# Altium schematic sheet Clocl.SchDoc
size A3
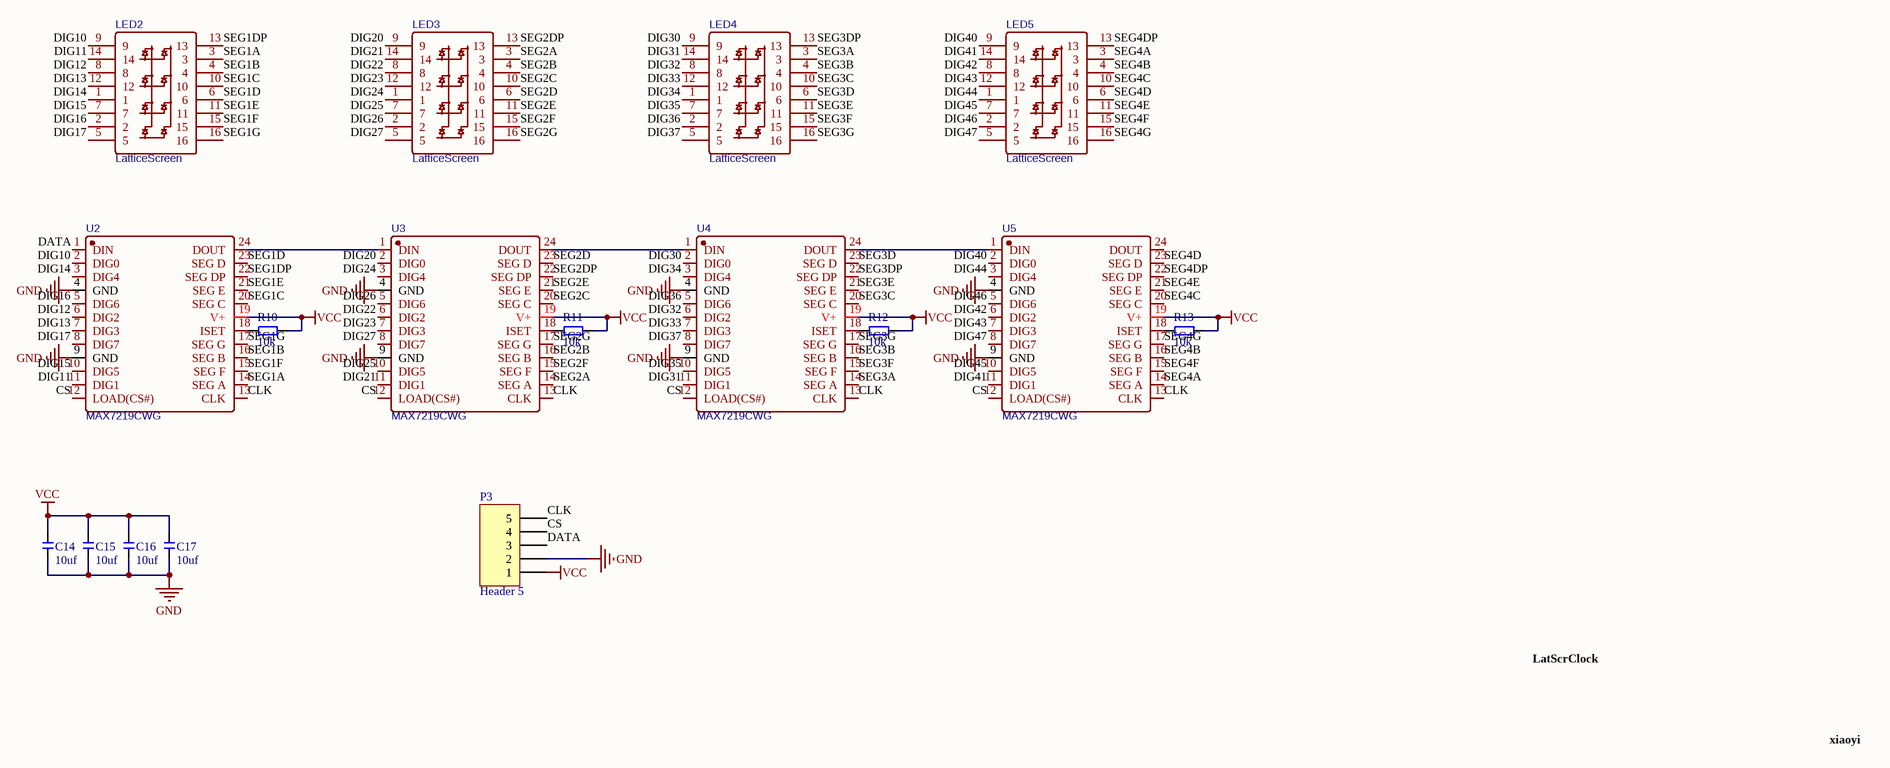
[diagram p0: Clocl.SchDoc]

## Parts
C14  10uf  [C0805]
C15  10uf  [C0805]
C16  10uf  [C0805]
C17  10uf  [C0805]
LED2  LatticeScreen  [SLD1388DRA1GD_20_withheaders]
LED3  LatticeScreen  [SLD1388DRA1GD_20_withheaders]
LED4  LatticeScreen  [SLD1388DRA1GD_20_withheaders]
LED5  LatticeScreen  [SLD1388DRA1GD_20_withheaders]
P3  Header 5  [HDR1X5]
R10  10k  [R0805]
R11  10k  [R0805]
R12  10k  [R0805]
R13  10k  [R0805]
U2  MAX7219CWG  [SOP-24_L15.2-W7.8-P1.27-LS10.6-BL]
U3  MAX7219CWG  [SOP-24_L15.2-W7.8-P1.27-LS10.6-BL]
U4  MAX7219CWG  [SOP-24_L15.2-W7.8-P1.27-LS10.6-BL]
U5  MAX7219CWG  [SOP-24_L15.2-W7.8-P1.27-LS10.6-BL]

## Nets
GND: C14.2 C15.2 C16.2 C17.2 P3.2 U2.4(GND) U2.9(GND) U3.4(GND) U3.9(GND) U4.4(GND) U4.9(GND) U5.4(GND) U5.9(GND)
VCC: C14.1 C15.1 C16.1 C17.1 P3.1 R10.1 R11.1 R12.1 R13.1 U2.19(V+) U3.19(V+) U4.19(V+) U5.19(V+)
CLK: P3.5 U2.13(CLK) U3.13(CLK) U4.13(CLK) U5.13(CLK)
CS: P3.4 U2.12(LOAD(CS#)) U3.12(LOAD(CS#)) U4.12(LOAD(CS#)) U5.12(LOAD(CS#))
DATA: P3.3 U2.1(DIN)
DIG10: LED2.9 U2.2(DIG0)
DIG11: LED2.14 U2.11(DIG1)
DIG12: LED2.8 U2.6(DIG2)
DIG13: LED2.12 U2.7(DIG3)
DIG14: LED2.1 U2.3(DIG4)
DIG15: LED2.7 U2.10(DIG5)
DIG16: LED2.2 U2.5(DIG6)
DIG17: LED2.5 U2.8(DIG7)
DIG20: LED3.9 U3.2(DIG0)
DIG21: LED3.14 U3.11(DIG1)
DIG22: LED3.8 U3.6(DIG2)
DIG23: LED3.12 U3.7(DIG3)
DIG24: LED3.1 U3.3(DIG4)
DIG25: LED3.7 U3.10(DIG5)
DIG26: LED3.2 U3.5(DIG6)
DIG27: LED3.5 U3.8(DIG7)
DIG30: LED4.9 U4.2(DIG0)
DIG31: LED4.14 U4.11(DIG1)
DIG32: LED4.8 U4.6(DIG2)
DIG33: LED4.12 U4.7(DIG3)
DIG34: LED4.1 U4.3(DIG4)
DIG35: LED4.7 U4.10(DIG5)
DIG36: LED4.2 U4.5(DIG6)
DIG37: LED4.5 U4.8(DIG7)
DIG40: LED5.9 U5.2(DIG0)
DIG41: LED5.14 U5.11(DIG1)
DIG42: LED5.8 U5.6(DIG2)
DIG43: LED5.12 U5.7(DIG3)
DIG44: LED5.1 U5.3(DIG4)
DIG45: LED5.7 U5.10(DIG5)
DIG46: LED5.2 U5.5(DIG6)
DIG47: LED5.5 U5.8(DIG7)
SEG1A: LED2.3 U2.14(SEG_A)
SEG1B: LED2.4 U2.16(SEG_B)
SEG1C: LED2.10 U2.20(SEG_C)
SEG1D: LED2.6 U2.23(SEG_D)
SEG1DP: LED2.13 U2.22(SEG_DP)
SEG1E: LED2.11 U2.21(SEG_E)
SEG1F: LED2.15 U2.15(SEG_F)
SEG1G: LED2.16 U2.17(SEG_G)
SEG2A: LED3.3 U3.14(SEG_A)
SEG2B: LED3.4 U3.16(SEG_B)
SEG2C: LED3.10 U3.20(SEG_C)
SEG2D: LED3.6 U3.23(SEG_D)
SEG2DP: LED3.13 U3.22(SEG_DP)
SEG2E: LED3.11 U3.21(SEG_E)
SEG2F: LED3.15 U3.15(SEG_F)
SEG2G: LED3.16 U3.17(SEG_G)
SEG3A: LED4.3 U4.14(SEG_A)
SEG3B: LED4.4 U4.16(SEG_B)
SEG3C: LED4.10 U4.20(SEG_C)
SEG3D: LED4.6 U4.23(SEG_D)
SEG3DP: LED4.13 U4.22(SEG_DP)
SEG3E: LED4.11 U4.21(SEG_E)
SEG3F: LED4.15 U4.15(SEG_F)
SEG3G: LED4.16 U4.17(SEG_G)
SEG4A: LED5.3 U5.14(SEG_A)
SEG4B: LED5.4 U5.16(SEG_B)
SEG4C: LED5.10 U5.20(SEG_C)
SEG4D: LED5.6 U5.23(SEG_D)
SEG4DP: LED5.13 U5.22(SEG_DP)
SEG4E: LED5.11 U5.21(SEG_E)
SEG4F: LED5.15 U5.15(SEG_F)
SEG4G: LED5.16 U5.17(SEG_G)
NetR10_2: R10.2 U2.18(ISET)
NetR11_2: R11.2 U3.18(ISET)
NetR12_2: R12.2 U4.18(ISET)
NetR13_2: R13.2 U5.18(ISET)
NetU2_24: U2.24(DOUT) U3.1(DIN)
NetU3_24: U3.24(DOUT) U4.1(DIN)
NetU4_24: U4.24(DOUT) U5.1(DIN)

Not connected (* = marked no-connect by the designer): U5 24(DOUT)

## Notes on the sheet
- LatScrClock
- xiaoyi

## Library data of the parts
C14-C17 = CAP: 无极电容; accuracy: 20%; value: 10uf
LED2-LED5 = LatticeScreen: 8*8共阴点阵屏; BOM_Manufacturer: SUNLIGHT; BOM_Manufacturer Part: SLD1388DRA1GD; Contributor: LCSC; BOM_Supplier: LCSC; BOM_Supplier Part: C225991; spicePre: L; spiceSymbolName: SLD1388DRA1GD
P3 = Header 5: Header, 5-Pin; LatestRevisionDate: 17-Jul-2002; LatestRevisionNote: Re-released for DXP Platform.; Publisher: Altium Limited
R10-R13 = RES: 电阻; Value: 10k
U2-U5 = MAX7219CWG: 共阴极显示驱动; BOM_Manufacturer: MAXIM; SMT Type: Extend; BOM_Supplier: LCSC; BOM_Manufacturer Part: MAX7219CWG; image: //image.lceda.cn/szlcsc/C9964.jpg; BOM_Supplier Part: C9964; BOM_LCSC Assembly: Yes; spicePre: U; spiceSymbolName: MAX7219CWG